# Altium schematic sheet calculation_plan.SchDoc
size A4
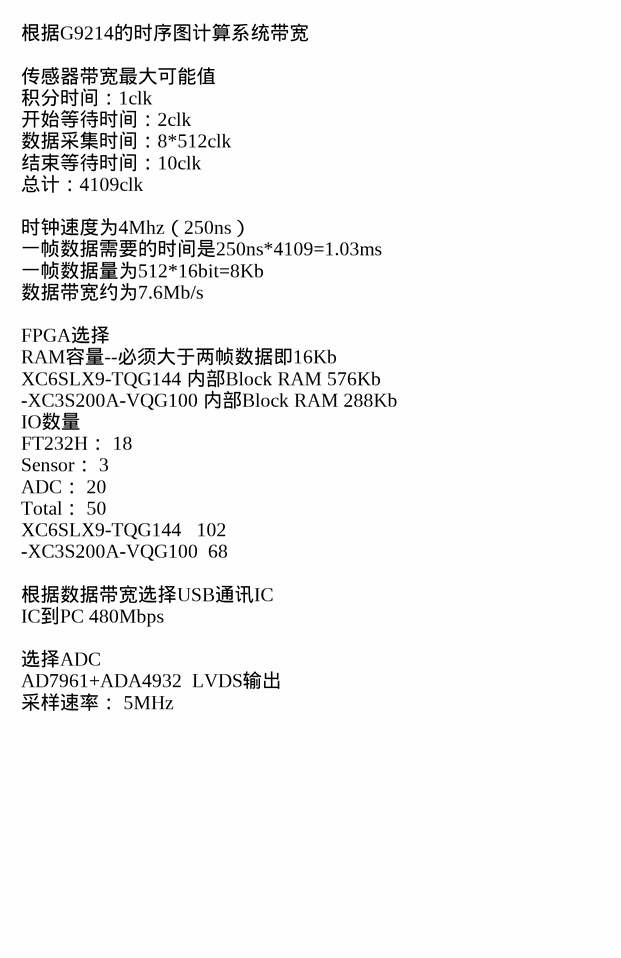
[diagram p0: calculation_plan.SchDoc]

## Notes on the sheet
- 根据G9214的时序图计算系统带宽
  传感器带宽最大可能值
  积分时间：1clk
  开始等待时间：2clk
  数据采集时间：8*512clk
  结束等待时间：10clk
  总计：4109clk
  时钟速度为4Mhz（250ns）
  一帧数据需要的时间是250ns*4109=1.03ms
  一帧数据量为512*16bit=8Kb
  数据带宽约为7.6Mb/s
  FPGA选择
  RAM容量--必须大于两帧数据即16Kb
  XC6SLX9-TQG144 内部Block RAM 576Kb
  -XC3S200A-VQG100 内部Block RAM 288Kb
  IO数量
  FT232H：	18
  Sensor：	3
  ADC：	20
  Total：	50
  XC6SLX9-TQG144 		102
  -XC3S200A-VQG100 	68
  根据数据带宽选择USB通讯IC
  IC到PC 480Mbps
  选择ADC
  AD7961+ADA4932		LVDS输出
  采样速率：	5MHz